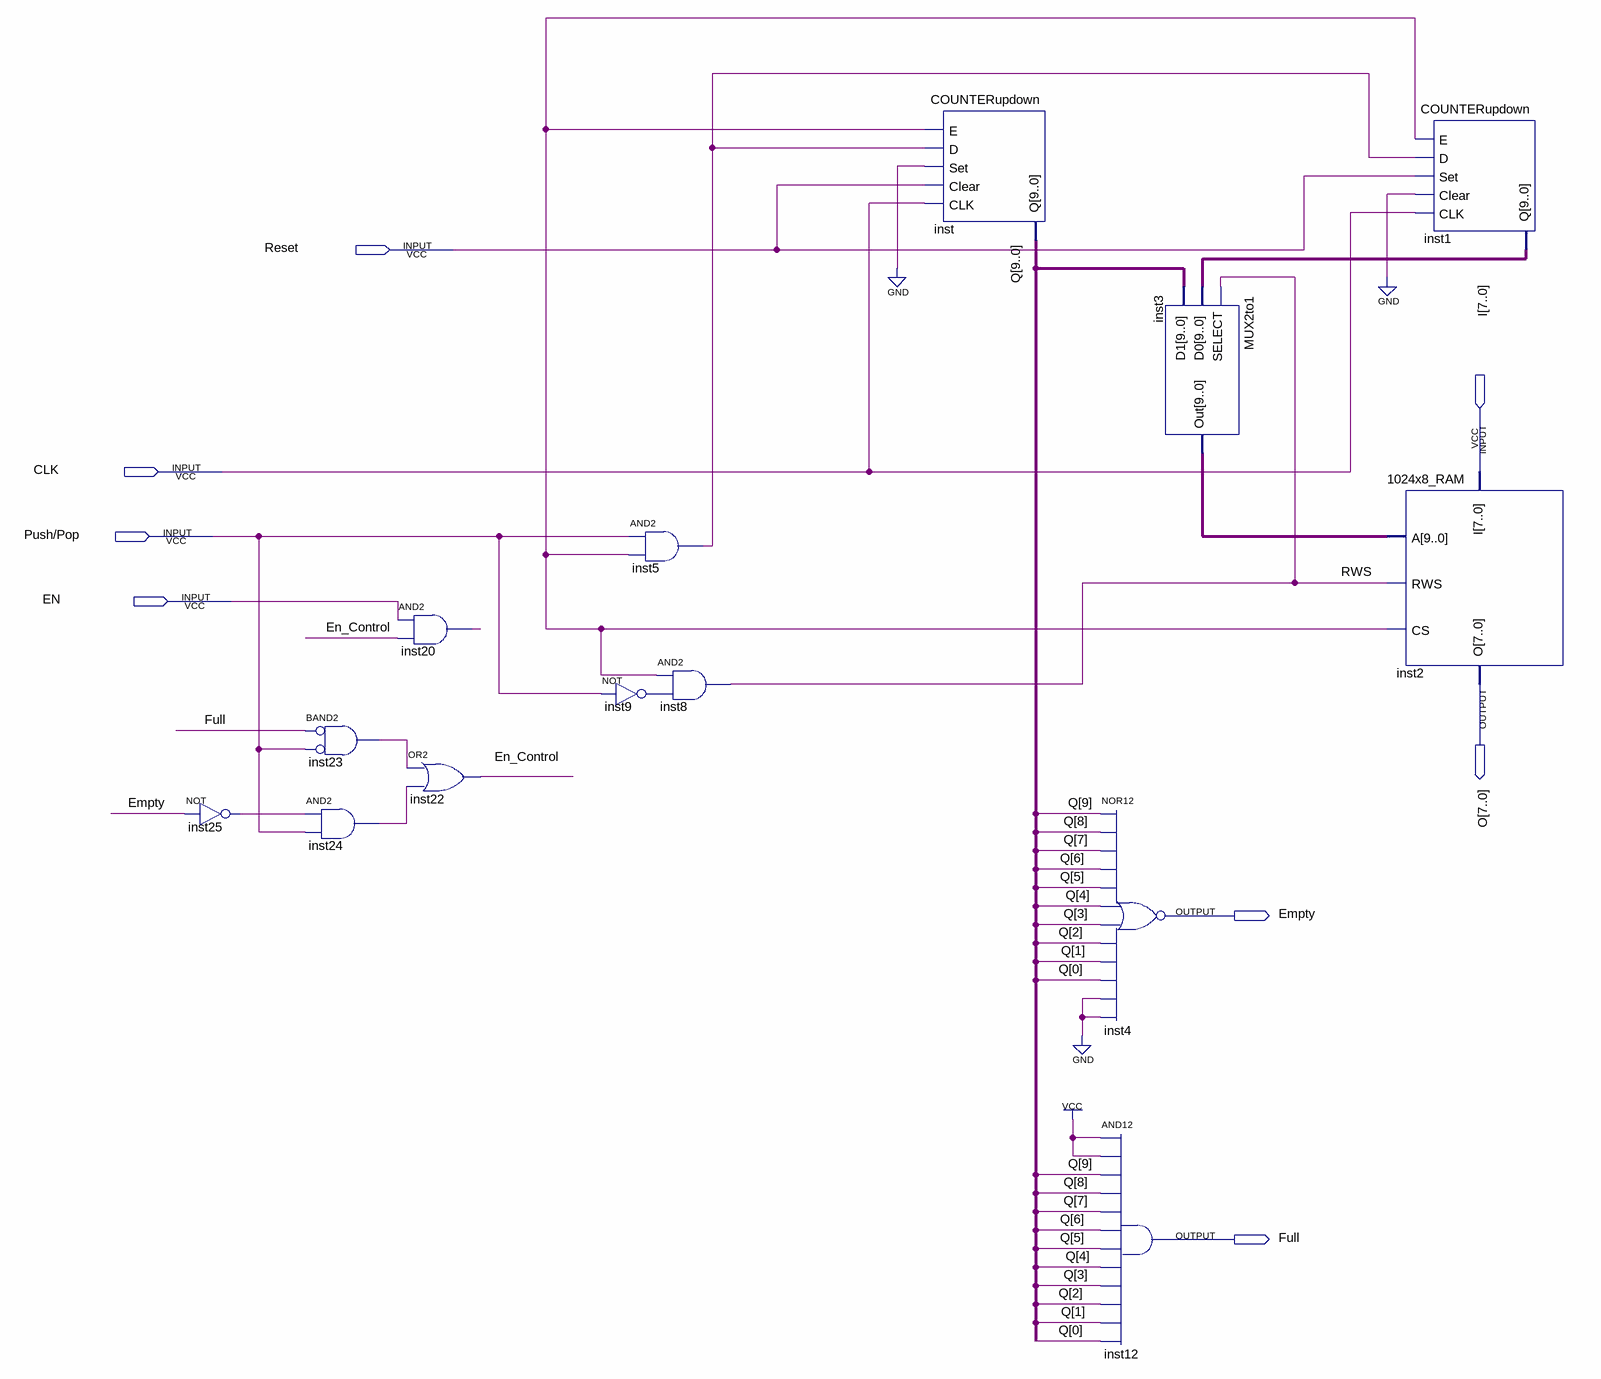
[diagram p0: schematic sheet]
// Quartus schematic Stack_1024x8.bdf as structural Verilog: 14 symbols, 8 pins
module Stack_1024x8 (
  input  Reset,
  input  CLK,
  input  [7:0] I,
  input  \Push/Pop ,
  input  EN,
  output [7:0] O,
  output Empty,
  output Full
);

  wire En_Control, inst5_out, inst9_out, inst20_out, inst23_out, inst24_out, inst25_out, RWS, undriven;
  wire [9:0] inst1_q, inst3_out, Q;

  not inst25 (inst25_out, Empty);
  and inst23 (inst23_out, ~Full, ~\Push/Pop );  // BAND2
  and inst24 (inst24_out, inst25_out, \Push/Pop );
  and inst20 (inst20_out, EN, En_Control);
  or inst22 (En_Control, inst23_out, inst24_out);
  and inst5 (inst5_out, \Push/Pop , undriven);
  not inst9 (inst9_out, \Push/Pop );
  and inst8 (RWS, undriven, inst9_out);
  COUNTERupdown inst (.E(undriven), .D(inst5_out), .Set(1'b0), .Clear(Reset), .CLK(CLK), .Q(Q));
  MUX2to1 inst3 (.SELECT(RWS), .D0(inst1_q), .D1(Q), .Out(inst3_out));
  nor inst4 (Empty, Q[9], Q[8], Q[7], Q[6], Q[5], Q[4], Q[3], Q[2], Q[1], Q[0], 1'b0, 1'b0);
  and inst12 (Full, 1'b1, 1'b1, Q[9], Q[8], Q[7], Q[6], Q[5], Q[4], Q[3], Q[2], Q[1], Q[0]);
  COUNTERupdown inst1 (.E(undriven), .D(inst5_out), .Set(Reset), .Clear(1'b0), .CLK(CLK), .Q(inst1_q));
  \1024x8_RAM  inst2 (.I(I), .A(inst3_out), .RWS(RWS), .CS(undriven), .O(O));
endmodule
